# EAGLE schematic pressure_rigid_v2_no_flex (EAGLE 9.3.1)
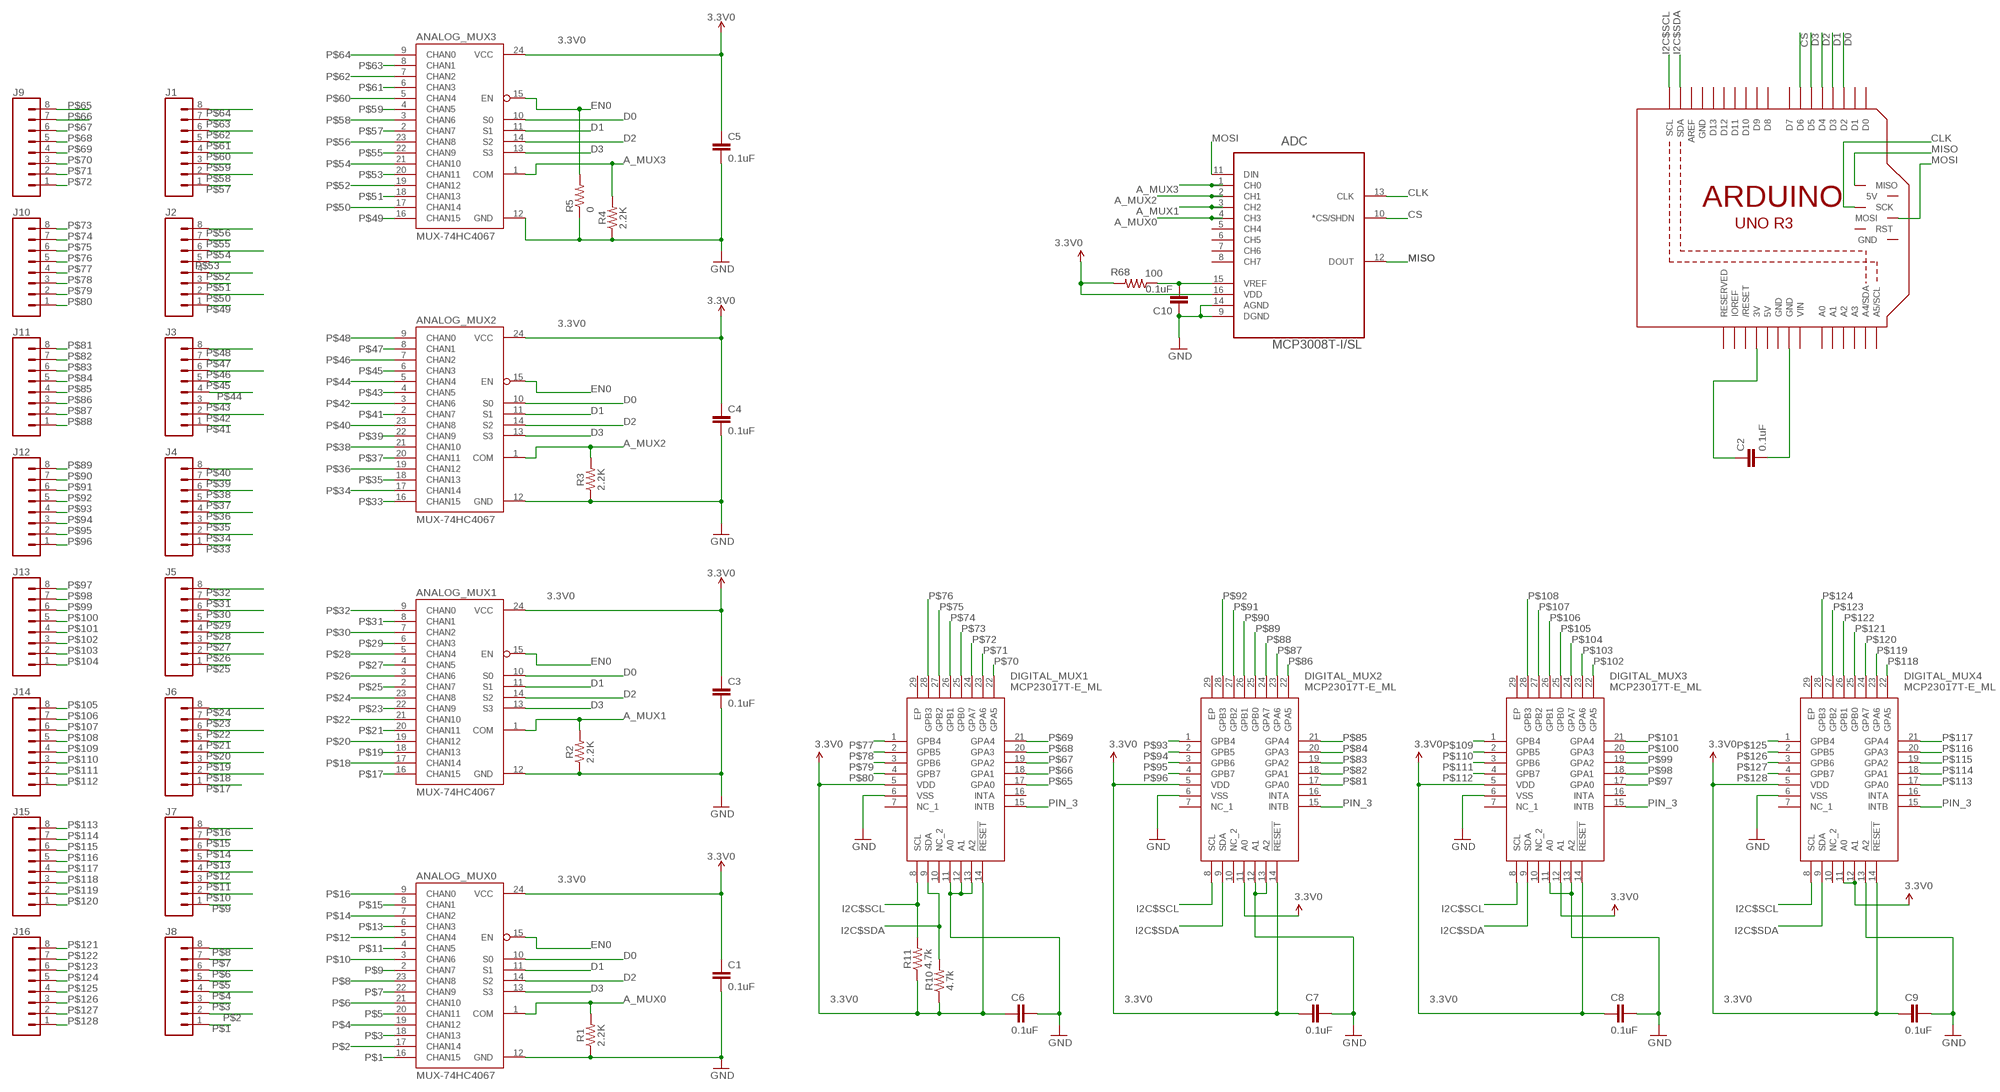
[diagram p0: schematic, sheet 1]

## Parts
ADC  MCP3008T-I/SL  [SOIC127P600X175-16N]
ANALOG_MUX0  MUX-74HC4067  MUX-74HC4067SMD  [SSOP24]
ANALOG_MUX1  MUX-74HC4067  MUX-74HC4067SMD  [SSOP24]
ANALOG_MUX2  MUX-74HC4067  MUX-74HC4067SMD  [SSOP24]
ANALOG_MUX3  MUX-74HC4067  MUX-74HC4067SMD  [SSOP24]
C1  0.1uF  0.1UF-0402-16V-10%  [0402]
C2  0.1uF  CAP0603  [0603]
C3  0.1uF  0.1UF-0402-16V-10%  [0402]
C4  0.1uF  0.1UF-0402-16V-10%  [0402]
C5  0.1uF  0.1UF-0402-16V-10%  [0402]
C6  0.1uF  0.1UF-0402-16V-10%  [0402]
C7  0.1uF  0.1UF-0402-16V-10%  [0402]
C8  0.1uF  0.1UF-0402-16V-10%  [0402]
C9  0.1uF  0.1UF-0402-16V-10%  [0402]
C10  0.1uF  0.1UF-0402-16V-10%  [0402]
DIGITAL_MUX1  MCP23017T-E_ML  [QFN65P600X600X100-29N]
DIGITAL_MUX2  MCP23017T-E_ML  [QFN65P600X600X100-29N]
DIGITAL_MUX3  MCP23017T-E_ML  [QFN65P600X600X100-29N]
DIGITAL_MUX4  MCP23017T-E_ML  [QFN65P600X600X100-29N]
J1  CONN_08SMD-STRAIGHT-FEMALE  [1X08_SMD]
J2  CONN_08SMD-STRAIGHT-FEMALE  [1X08_SMD]
J3  CONN_08SMD-STRAIGHT-FEMALE  [1X08_SMD]
J4  CONN_08SMD-STRAIGHT-FEMALE  [1X08_SMD]
J5  CONN_08SMD-STRAIGHT-FEMALE  [1X08_SMD]
J6  CONN_08SMD-STRAIGHT-FEMALE  [1X08_SMD]
J7  CONN_08SMD-STRAIGHT-FEMALE  [1X08_SMD]
J8  CONN_08SMD-STRAIGHT-FEMALE  [1X08_SMD]
J9  CONN_08SMD-STRAIGHT-FEMALE  [1X08_SMD]
J10  CONN_08SMD-STRAIGHT-FEMALE  [1X08_SMD]
J11  CONN_08SMD-STRAIGHT-FEMALE  [1X08_SMD]
J12  CONN_08SMD-STRAIGHT-FEMALE  [1X08_SMD]
J13  CONN_08SMD-STRAIGHT-FEMALE  [1X08_SMD]
J14  CONN_08SMD-STRAIGHT-FEMALE  [1X08_SMD]
J15  CONN_08SMD-STRAIGHT-FEMALE  [1X08_SMD]
J16  CONN_08SMD-STRAIGHT-FEMALE  [1X08_SMD]
M1  ARDUINO_R3_ICSP_NODIM  [ARDUINOR3_ICSP_NODIM]
R1  2.2K  100KOHM-0402-1/16W-1%  [0402]
R2  2.2K  100KOHM-0402-1/16W-1%  [0402]
R3  2.2K  100KOHM-0402-1/16W-1%  [0402]
R4  2.2K  100KOHM-0402-1/16W-1%  [0402]
R5  0  RESISTOR0603  [0603]
R10  4.7k  4.7KOHM-0603-1/10W-1%  [0603]
R11  4.7k  4.7KOHM-0603-1/10W-1%  [0603]
R68  100  RESISTOR0603  [0603]

## Nets
3.3V0 [supply]: ANALOG_MUX0.24(VCC) ANALOG_MUX1.24(VCC) ANALOG_MUX2.24(VCC) ANALOG_MUX3.24(VCC) C1.1 C3.1 C4.1 C5.1 C6.1 C7.1 C8.1 C9.1 DIGITAL_MUX1.5(VDD) DIGITAL_MUX1.14(!RESET) DIGITAL_MUX2.5(VDD) DIGITAL_MUX2.14(!RESET) DIGITAL_MUX3.5(VDD) DIGITAL_MUX3.14(!RESET) DIGITAL_MUX4.5(VDD) DIGITAL_MUX4.14(!RESET) R10.1 R11.1
A_MUX0: ADC.4(CH3) ANALOG_MUX0.1(COM) R1.2
A_MUX1: ADC.3(CH2) ANALOG_MUX1.1(COM) R2.2
A_MUX2: ADC.2(CH1) ANALOG_MUX2.1(COM) R3.2
A_MUX3: ADC.1(CH0) ANALOG_MUX3.1(COM) R4.2
CLK: ADC.13(CLK) M1.SCK
CS: ADC.10(*CS/SHDN) M1.D6
D0: ANALOG_MUX0.10(S0) ANALOG_MUX1.10(S0) ANALOG_MUX2.10(S0) ANALOG_MUX3.10(S0) M1.D2
D1: ANALOG_MUX0.11(S1) ANALOG_MUX1.11(S1) ANALOG_MUX2.11(S1) ANALOG_MUX3.11(S1) M1.D3
D2: ANALOG_MUX0.14(S2) ANALOG_MUX1.14(S2) ANALOG_MUX2.14(S2) ANALOG_MUX3.14(S2) M1.D4
D3: ANALOG_MUX0.13(S3) ANALOG_MUX1.13(S3) ANALOG_MUX2.13(S3) ANALOG_MUX3.13(S3) M1.D5
EN0: ANALOG_MUX0.15(EN) ANALOG_MUX1.15(EN) ANALOG_MUX2.15(EN) ANALOG_MUX3.15(EN) R5.2
GND [supply]: ADC.9(DGND) ADC.14(AGND) ANALOG_MUX0.12(GND) ANALOG_MUX1.12(GND) ANALOG_MUX2.12(GND) ANALOG_MUX3.12(GND) C1.2 C3.2 C4.2 C5.2 C6.2 C7.2 C8.2 C9.2 C10.1 DIGITAL_MUX1.6(VSS) DIGITAL_MUX1.11(A0) DIGITAL_MUX1.12(A1) DIGITAL_MUX1.13(A2) DIGITAL_MUX2.6(VSS) DIGITAL_MUX2.12(A1) DIGITAL_MUX2.13(A2) DIGITAL_MUX3.6(VSS) DIGITAL_MUX3.11(A0) DIGITAL_MUX3.13(A2) DIGITAL_MUX4.6(VSS) DIGITAL_MUX4.13(A2) R1.1 R2.1 R3.1 R4.1 R5.1
I2C$SCL: DIGITAL_MUX1.8(SCL) DIGITAL_MUX2.8(SCL) DIGITAL_MUX3.8(SCL) DIGITAL_MUX4.8(SCL) M1.SCL R11.2
I2C$SDA: DIGITAL_MUX1.9(SDA) DIGITAL_MUX2.9(SDA) DIGITAL_MUX3.9(SDA) DIGITAL_MUX4.9(SDA) M1.SDA R10.2
MISO: ADC.12(DOUT) M1.MISO
MOSI: ADC.11(DIN) M1.MOSI
N$1: ADC.15(VREF) C10.2 R68.1
N$66 [supply]: C2.2 M1.GND@3(GND)
N$67 [supply]: C2.1 M1.3V
P$1: ANALOG_MUX0.16(CHAN15) J8.1
P$2: ANALOG_MUX0.17(CHAN14) J8.2
P$3: ANALOG_MUX0.18(CHAN13) J8.3
P$4: ANALOG_MUX0.19(CHAN12) J8.4
P$5: ANALOG_MUX0.20(CHAN11) J8.5
P$6: ANALOG_MUX0.21(CHAN10) J8.6
P$7: ANALOG_MUX0.22(CHAN9) J8.7
P$8: ANALOG_MUX0.23(CHAN8) J8.8
P$9: ANALOG_MUX0.2(CHAN7) J7.1
P$10: ANALOG_MUX0.3(CHAN6) J7.2
P$11: ANALOG_MUX0.4(CHAN5) J7.3
P$12: ANALOG_MUX0.5(CHAN4) J7.4
P$13: ANALOG_MUX0.6(CHAN3) J7.5
P$14: ANALOG_MUX0.7(CHAN2) J7.6
P$15: ANALOG_MUX0.8(CHAN1) J7.7
P$16: ANALOG_MUX0.9(CHAN0) J7.8
P$17: ANALOG_MUX1.16(CHAN15) J6.1
P$18: ANALOG_MUX1.17(CHAN14) J6.2
P$19: ANALOG_MUX1.18(CHAN13) J6.3
P$20: ANALOG_MUX1.19(CHAN12) J6.4
P$21: ANALOG_MUX1.20(CHAN11) J6.5
P$22: ANALOG_MUX1.21(CHAN10) J6.6
P$23: ANALOG_MUX1.22(CHAN9) J6.7
P$24: ANALOG_MUX1.23(CHAN8) J6.8
P$25: ANALOG_MUX1.2(CHAN7) J5.1
P$26: ANALOG_MUX1.3(CHAN6) J5.2
P$27: ANALOG_MUX1.4(CHAN5) J5.3
P$28: ANALOG_MUX1.5(CHAN4) J5.4
P$29: ANALOG_MUX1.6(CHAN3) J5.5
P$30: ANALOG_MUX1.7(CHAN2) J5.6
P$31: ANALOG_MUX1.8(CHAN1) J5.7
P$32: ANALOG_MUX1.9(CHAN0) J5.8
P$33: ANALOG_MUX2.16(CHAN15) J4.1
P$34: ANALOG_MUX2.17(CHAN14) J4.2
P$35: ANALOG_MUX2.18(CHAN13) J4.3
P$36: ANALOG_MUX2.19(CHAN12) J4.4
P$37: ANALOG_MUX2.20(CHAN11) J4.5
P$38: ANALOG_MUX2.21(CHAN10) J4.6
P$39: ANALOG_MUX2.22(CHAN9) J4.7
P$40: ANALOG_MUX2.23(CHAN8) J4.8
P$41: ANALOG_MUX2.2(CHAN7) J3.1
P$42: ANALOG_MUX2.3(CHAN6) J3.2
P$43: ANALOG_MUX2.4(CHAN5) J3.3
P$44: ANALOG_MUX2.5(CHAN4) J3.4
P$45: ANALOG_MUX2.6(CHAN3) J3.5
P$46: ANALOG_MUX2.7(CHAN2) J3.6
P$47: ANALOG_MUX2.8(CHAN1) J3.7
P$48: ANALOG_MUX2.9(CHAN0) J3.8
P$49: ANALOG_MUX3.16(CHAN15) J2.1
P$50: ANALOG_MUX3.17(CHAN14) J2.2
P$51: ANALOG_MUX3.18(CHAN13) J2.3
P$52: ANALOG_MUX3.19(CHAN12) J2.4
P$53: ANALOG_MUX3.20(CHAN11) J2.5
P$54: ANALOG_MUX3.21(CHAN10) J2.6
P$55: ANALOG_MUX3.22(CHAN9) J2.7
P$56: ANALOG_MUX3.23(CHAN8) J2.8
P$57: ANALOG_MUX3.2(CHAN7) J1.1
P$58: ANALOG_MUX3.3(CHAN6) J1.2
P$59: ANALOG_MUX3.4(CHAN5) J1.3
P$60: ANALOG_MUX3.5(CHAN4) J1.4
P$61: ANALOG_MUX3.6(CHAN3) J1.5
P$62: ANALOG_MUX3.7(CHAN2) J1.6
P$63: ANALOG_MUX3.8(CHAN1) J1.7
P$64: ANALOG_MUX3.9(CHAN0) J1.8
P$65: DIGITAL_MUX1.17(GPA0) J9.8
P$66: DIGITAL_MUX1.18(GPA1) J9.7
P$67: DIGITAL_MUX1.19(GPA2) J9.6
P$68: DIGITAL_MUX1.20(GPA3) J9.5
P$69: DIGITAL_MUX1.21(GPA4) J9.4
P$70: DIGITAL_MUX1.22(GPA5) J9.3
P$71: DIGITAL_MUX1.23(GPA6) J9.2
P$72: DIGITAL_MUX1.24(GPA7) J9.1
P$73: DIGITAL_MUX1.25(GPB0) J10.8
P$74: DIGITAL_MUX1.26(GPB1) J10.7
P$75: DIGITAL_MUX1.27(GPB2) J10.6
P$76: DIGITAL_MUX1.28(GPB3) J10.5
P$77: DIGITAL_MUX1.1(GPB4) J10.4
P$78: DIGITAL_MUX1.2(GPB5) J10.3
P$79: DIGITAL_MUX1.3(GPB6) J10.2
P$80: DIGITAL_MUX1.4(GPB7) J10.1
P$81: DIGITAL_MUX2.17(GPA0) J11.8
P$82: DIGITAL_MUX2.18(GPA1) J11.7
P$83: DIGITAL_MUX2.19(GPA2) J11.6
P$84: DIGITAL_MUX2.20(GPA3) J11.5
P$85: DIGITAL_MUX2.21(GPA4) J11.4
P$86: DIGITAL_MUX2.22(GPA5) J11.3
P$87: DIGITAL_MUX2.23(GPA6) J11.2
P$88: DIGITAL_MUX2.24(GPA7) J11.1
P$89: DIGITAL_MUX2.25(GPB0) J12.8
P$90: DIGITAL_MUX2.26(GPB1) J12.7
P$91: DIGITAL_MUX2.27(GPB2) J12.6
P$92: DIGITAL_MUX2.28(GPB3) J12.5
P$93: DIGITAL_MUX2.1(GPB4) J12.4
P$94: DIGITAL_MUX2.2(GPB5) J12.3
P$95: DIGITAL_MUX2.3(GPB6) J12.2
P$96: DIGITAL_MUX2.4(GPB7) J12.1
P$97: DIGITAL_MUX3.17(GPA0) J13.8
P$98: DIGITAL_MUX3.18(GPA1) J13.7
P$99: DIGITAL_MUX3.19(GPA2) J13.6
P$100: DIGITAL_MUX3.20(GPA3) J13.5
P$101: DIGITAL_MUX3.21(GPA4) J13.4
P$102: DIGITAL_MUX3.22(GPA5) J13.3
P$103: DIGITAL_MUX3.23(GPA6) J13.2
P$104: DIGITAL_MUX3.24(GPA7) J13.1
P$105: DIGITAL_MUX3.25(GPB0) J14.8
P$106: DIGITAL_MUX3.26(GPB1) J14.7
P$107: DIGITAL_MUX3.27(GPB2) J14.6
P$108: DIGITAL_MUX3.28(GPB3) J14.5
P$109: DIGITAL_MUX3.1(GPB4) J14.4
P$110: DIGITAL_MUX3.2(GPB5) J14.3
P$111: DIGITAL_MUX3.3(GPB6) J14.2
P$112: DIGITAL_MUX3.4(GPB7) J14.1
P$113: DIGITAL_MUX4.17(GPA0) J15.8
P$114: DIGITAL_MUX4.18(GPA1) J15.7
P$115: DIGITAL_MUX4.19(GPA2) J15.6
P$116: DIGITAL_MUX4.20(GPA3) J15.5
P$117: DIGITAL_MUX4.21(GPA4) J15.4
P$118: DIGITAL_MUX4.22(GPA5) J15.3
P$119: DIGITAL_MUX4.23(GPA6) J15.2
P$120: DIGITAL_MUX4.24(GPA7) J15.1
P$121: DIGITAL_MUX4.25(GPB0) J16.8
P$122: DIGITAL_MUX4.26(GPB1) J16.7
P$123: DIGITAL_MUX4.27(GPB2) J16.6
P$124: DIGITAL_MUX4.28(GPB3) J16.5
P$125: DIGITAL_MUX4.1(GPB4) J16.4
P$126: DIGITAL_MUX4.2(GPB5) J16.3
P$127: DIGITAL_MUX4.3(GPB6) J16.2
P$128: DIGITAL_MUX4.4(GPB7) J16.1
PIN_3: DIGITAL_MUX1.15(INTB) DIGITAL_MUX2.15(INTB) DIGITAL_MUX3.15(INTB) DIGITAL_MUX4.15(INTB)
VCC [supply]: ADC.16(VDD) DIGITAL_MUX2.11(A0) DIGITAL_MUX3.12(A1) DIGITAL_MUX4.11(A0) DIGITAL_MUX4.12(A1) R68.2 ; supply symbol labelled 3.3V0
Unconnected: ADC.5(CH4) ADC.6(CH5) ADC.7(CH6) ADC.8(CH7) DIGITAL_MUX1.7(NC_1) DIGITAL_MUX1.10(NC_2) DIGITAL_MUX1.16(INTA) DIGITAL_MUX1.29(EP) DIGITAL_MUX2.7(NC_1) DIGITAL_MUX2.10(NC_2) DIGITAL_MUX2.16(INTA) DIGITAL_MUX2.29(EP) DIGITAL_MUX3.7(NC_1) DIGITAL_MUX3.10(NC_2) DIGITAL_MUX3.16(INTA) DIGITAL_MUX3.29(EP) DIGITAL_MUX4.7(NC_1) DIGITAL_MUX4.10(NC_2) DIGITAL_MUX4.16(INTA) DIGITAL_MUX4.29(EP) M1.5V_ICSP(5V) M1.A0 M1.A1 M1.A2 M1.A3 M1.A4(A4/SDA) M1.A5(A5/SCL) M1.AREF M1.D0 M1.D1 M1.D7 M1.D8 M1.D9 M1.D10 M1.D11 M1.D12 M1.D13 M1.GND@2(GND) M1.IOREF M1.RESERVED M1.RESET(/RESET) M1.RESET_ICSP(RST)

## Power pins joined to a net without a drawn wire
5V: M1.5V
GND: M1.GND M1.GND@1(GND)
VIN: M1.VIN

## Library data of the parts
ADC = MCP3008 not a duplicate:MCP3008T-I/SL: 10BIT ADC, 8 CH, SPI, SMD; DESCRIPTION: Eight Channel SPI Serial Interface 2.7 V 10-Bit A/D Converter SMT - SOIC-16; DIGI-KEY_PART_NUMBER: MCP3008T-I/SLCT-ND; DIGI-KEY_PURCHASE_URL: https://www.digikey.com/product-detail/en/microchip-technology/MCP3008T-I-SL/MCP3008T-I-SLCT-ND/5148847?utm_source=snapeda&utm_medium=aggregator&utm_campaign=symbol; MF: Microchip; MP: MCP3008T-I/SL; PACKAGE: SOIC-16 Microchip
ANALOG_MUX0 ANALOG_MUX1-ANALOG_MUX3 = SparkFun:MUX-74HC4067
C1 C3-C10 = SparkFun-Capacitors:0.1UF: 0.1µF ceramic capacitors A capacitor is a passive two-terminal electrical component used to store electrical energy temporarily in an electric field.; PROD_ID: CAP-12416
C2 = SparkFun:CAP: Capacitor Standard 0603 ceramic capacitor, and 0.1" leaded capacitor.
DIGITAL_MUX1-DIGITAL_MUX4 = SamacSys_Parts:MCP23017T-E_ML: Interface - I/O Expanders 16bit Input/Output Exp I2C interface Source: Datasheet <http://www.mouser.com/datasheet/2/268/20001952C-1129816.pdf>; DESCRIPTION: Interface - I/O Expanders 16bit Input/Output Exp I2C interface; HEIGHT: 1mm; MANUFACTURER_NAME: Microchip; MANUFACTURER_PART_NUMBER: MCP23017T-E/ML; MOUSER_PART_NUMBER: 579-MCP23017T-E/ML
J1-J16 = SparkFun-Connectors:CONN_08: Multi connection point. Often used as Generic Header-pin footprint for 0.1 inch spaced/style header connections On any of the 0.1 inch spaced packages, you can populate with these: Break Away Headers - Straight <https://www.sparkfun.com/products/116> (PRT-00116) Break Away Male Headers - Right Angle <https://www.sparkfun.com/products/553> (PRT-00553) Female Headers <https://www.sparkfun.com/products/115> (PRT-00115) Break Away Headers - Machine Pin <https://www.sparkfun.com/products/117> (PRT-00117) Break Away Female Headers - Swiss Machine Pin <https://www.sparkfun.com/products/743> (PRT-00743) Arduino Stackable Header - 8 Pin <https://www.sparkfun.com/products/9279> (PRT-09279) For SCREWTERMINALS and SPRING TERMINALS visit here: Screw Terimnals on SparkFun.com <https://www.sparkfun.com/search/results?term=Screw+Terminals> (5mm/3.5mm/2.54mm spacing) This device is also useful as a general connection point to wire up your design to another part of your project. Our various solder wires solder well into these plated through hole pads. Hook-Up Wire - Assortment (Stranded, 22 AWG) <https://www.sparkfun.com/products/11375> (PRT-11375) Hook-Up Wire - Assortment (Solid Core, 22 AWG) <https://www.sparkfun.com/products/11367> (PRT-11367) View the entire wire category on our website here <https://www.sparkfun.com/categories/141> Special notes: Molex polarized connector foot print use with SKU : PRT-08231 with associated crimp pins and housings. 1MM SMD Version SKU: PRT-10208 NOTES ON THE VARIANTS LOCK and LOCK_LONGPADS... This footprint was designed to help hold the alignment of a through-hole component (i.e. 6-pin header) while soldering it into place. You may notice that each hole has been shifted either up or down by 0.005 of an inch from it's more standard position (which is a perfectly straight line). This slight alteration caused the pins (the squares in the middle) to touch the edges of the holes. Because they are alternating, it causes a "brace" to hold the component in place. 0.005 has proven to be the perfect amount of "off-center" position when using our standard breakaway headers. Although looks a little odd when you look at the bare footprint, once you have a header in there, the alteration is very hard to notice. Also,if you push a header all the way into place, it is covered up entirely on the bottom side.; PROD_ID: CONN-10204; SF_ID: PRT-11543
M1 = adafruit:ARDUINO_R3_ICSP
R1-R4 = SparkFun-Resistors:100KOHM: 100kΩ resistor A resistor is a passive two-terminal electrical component that implements electrical resistance as a circuit element. Resistors act to reduce current flow, and, at the same time, act to lower voltage levels within circuits. - Wikipedia; PROD_ID: RES-13495; VALUE: 100K
R5 R68 = SparkFun:RESISTOR: Resistor Basic schematic elements and footprints for 0603, 1206, and PTH 1/10th watt (small) resistors.
R10 R11 = SparkFun-Resistors:4.7KOHM: 4.7kΩ resistor A resistor is a passive two-terminal electrical component that implements electrical resistance as a circuit element. Resistors act to reduce current flow, and, at the same time, act to lower voltage levels within circuits. - Wikipedia; PROD_ID: RES-07857

## Net classes
1 supply: width 0.076 mm, drill 0.076 mm, clearance 0.076 mm